# Altium schematic sheet Wifi.SchDoc: Wifi_Main
size A3; Author: TueTD; DrawnBy: TueTD; DocumentNumber: 1; Revision: V1.0; SheetNumber: 1; Stage: DRAFT; ENG_APP_DATE: --/--/--; DSN_APP_DATE: --/--/--; CHK_APP_DATE: --/--/--
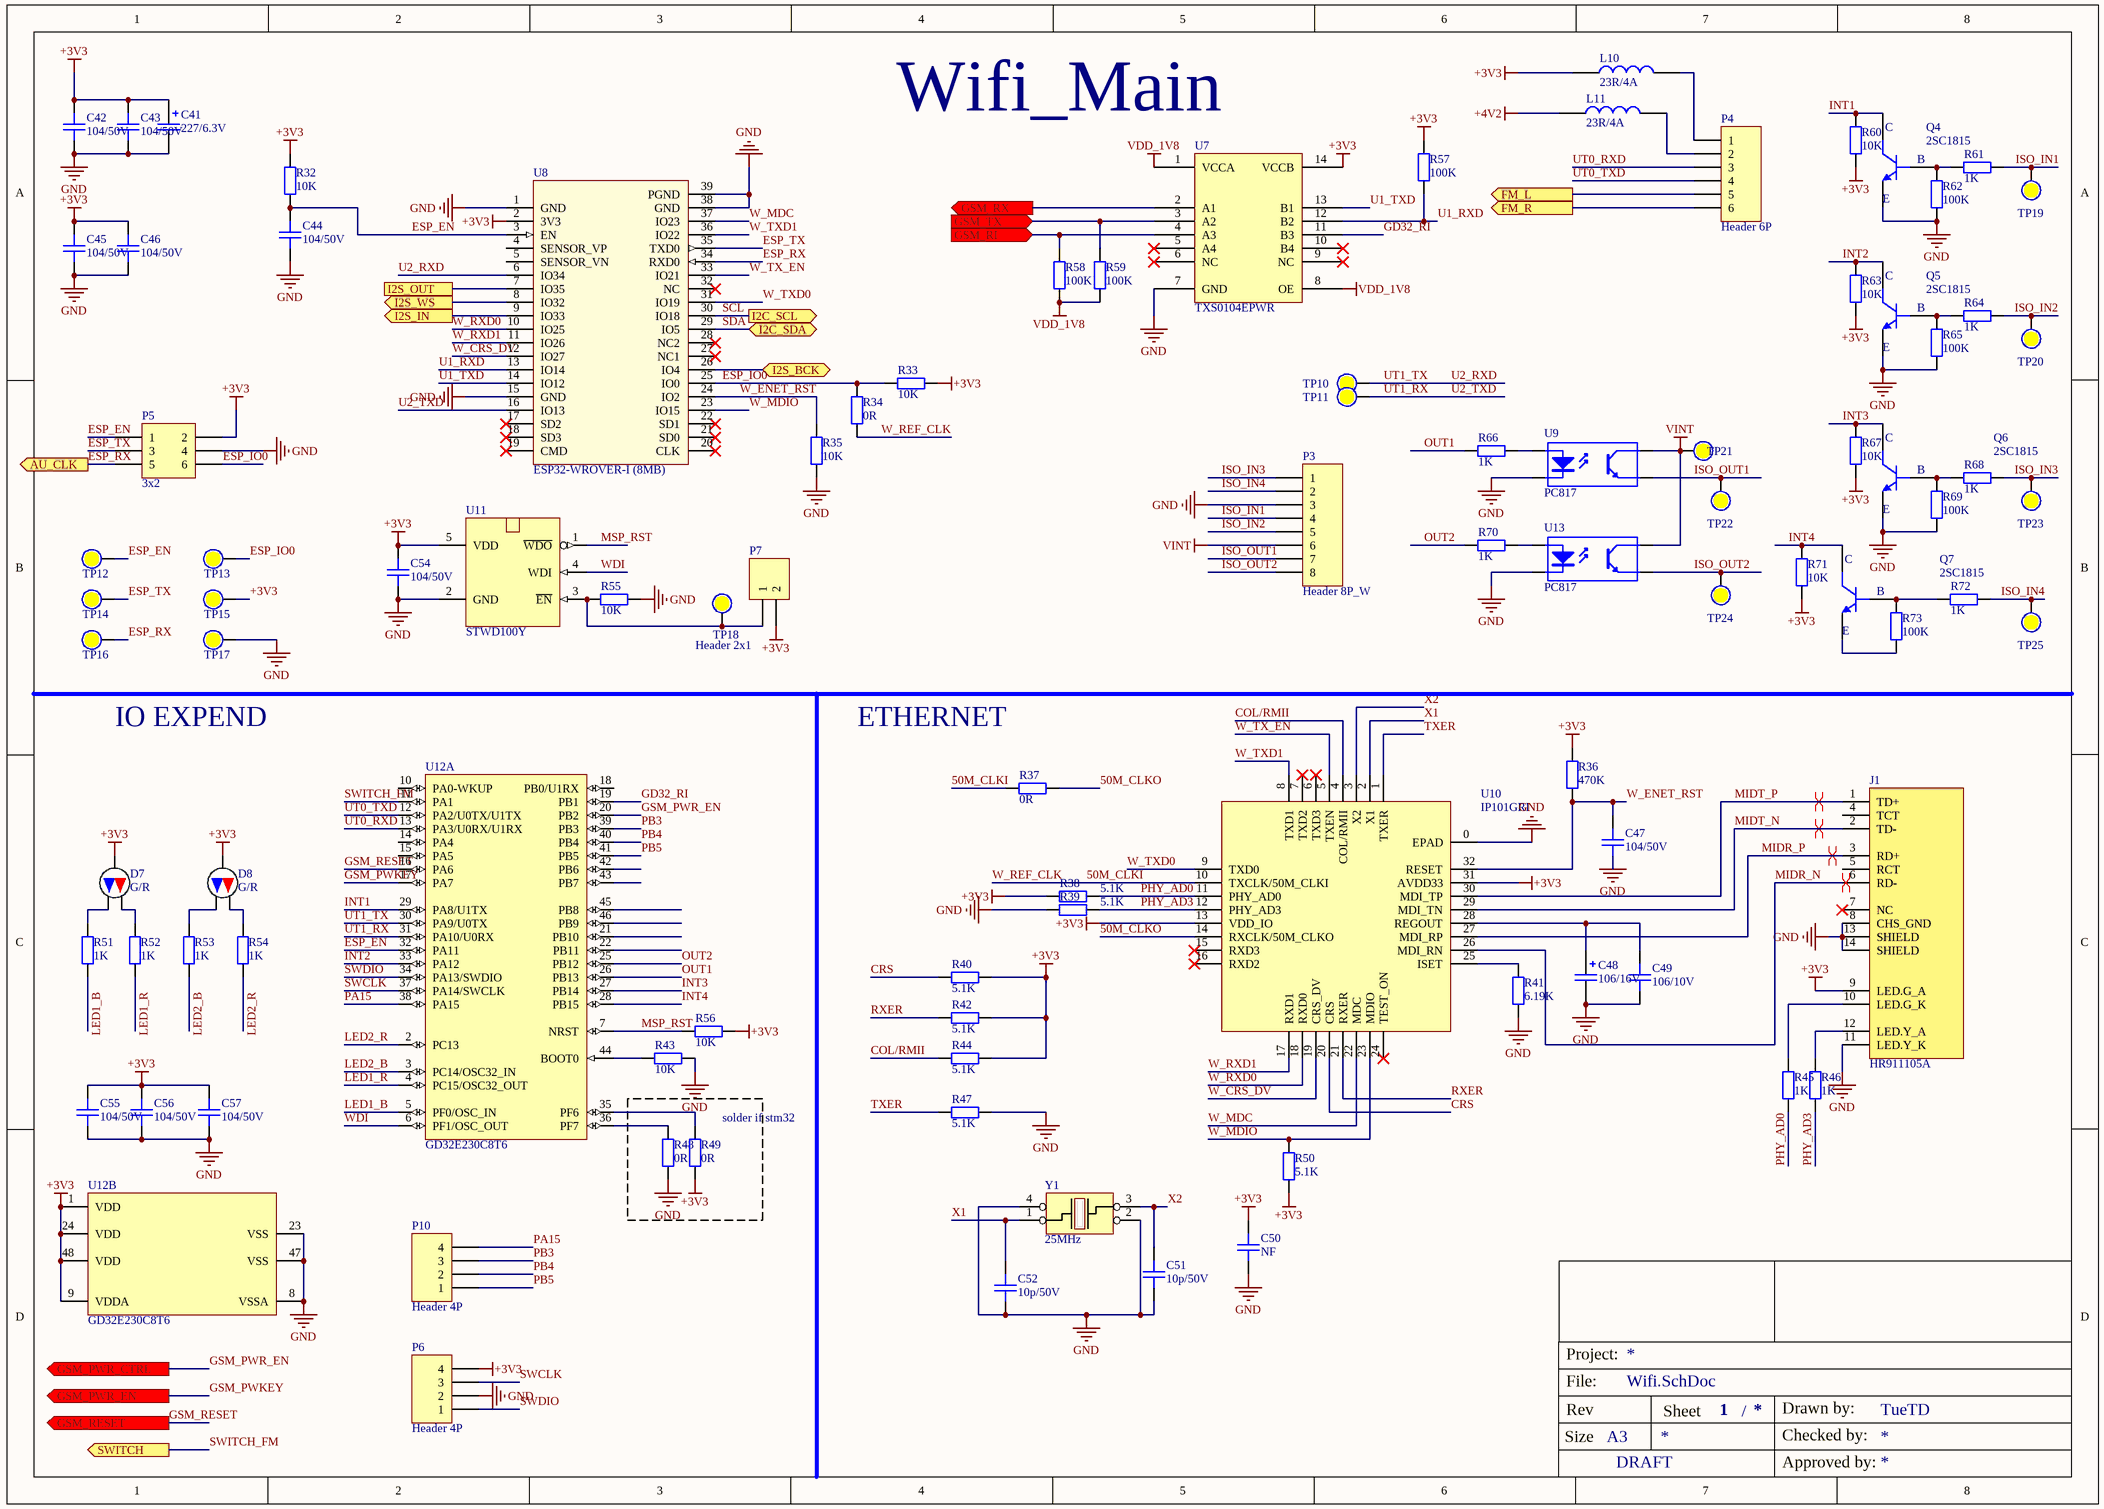
[diagram p0: Wifi.SchDoc]

## Parts
C41  227/6.3V  [CAP_TANTAL_1210(3528)]
C42  104/50V  [CAPC-0603 (1608)]
C43  104/50V  [CAPC-0603 (1608)]
C44  104/50V  [CAPC-0603 (1608)]
C45  104/50V  [CAPC-0603 (1608)]
C46  104/50V  [CAPC-0603 (1608)]
C47  104/50V  [CAPC-0603 (1608)]
C48  106/16V  [CAP_TANTAL_1210(3528)]
C49  106/10V  [CAPC-0603 (1608)]
C50  NF  [CAPC-0603 (1608)]
C51  10p/50V  [CAPC-0603 (1608)]
C52  10p/50V  [CAPC-0603 (1608)]
C54  104/50V  [CAPC-0603 (1608)]
C55  104/50V  [CAPC-0603 (1608)]
C56  104/50V  [CAPC-0603 (1608)]
C57  104/50V  [CAPC-0603 (1608)]
D7  G/R  [LED3301-15]
D8  G/R  [LED3301-15]
J1  HR911105A  [HR911105A]
L10  23R/4A  [IND-0603 (1608)]
L11  23R/4A  [IND-0603 (1608)]
P3  Header 8P_W  [HDR1X8 - W]
P4  Header 6P  [HDR1X6 - W]
P5  3x2  [IDE6 1.27mm]
P6  Header 4P  [HDR1X4]
P7  Header 2x1  [HDR1X2]
P10  Header 4P  [HDR1X4]
Q4  2SC1815  [SOT23_3]
Q5  2SC1815  [SOT23_3]
Q6  2SC1815  [SOT23_3]
Q7  2SC1815  [SOT23_3]
R32  10K  [RESC-0603 (1608)]
R33  10K  [RESC-0603 (1608)]
R34  0R  [RESC-0603 (1608)]
R35  10K  [RESC-0603 (1608)]
R36  470K  [RESC-0603 (1608)]
R37  0R  [RESC-0603 (1608)]
R38  5.1K  [RESC-0603 (1608)]
R39  5.1K  [RESC-0603 (1608)]
R40  5.1K  [RESC-0603 (1608)]
R41  6.19K  [RESC-0603 (1608)]
R42  5.1K  [RESC-0603 (1608)]
R43  10K  [RESC-0603 (1608)]
R44  5.1K  [RESC-0603 (1608)]
R45  1K  [RESC-0603 (1608)]
R46  1K  [RESC-0603 (1608)]
R47  5.1K  [RESC-0603 (1608)]
R48  0R  [RESC-0603 (1608)]
R49  0R  [RESC-0603 (1608)]
R50  5.1K  [RESC-0603 (1608)]
R51  1K  [RESC-0603 (1608)]
R52  1K  [RESC-0603 (1608)]
R53  1K  [RESC-0603 (1608)]
R54  1K  [RESC-0603 (1608)]
R55  10K  [RESC-0603 (1608)]
R56  10K  [RESC-0603 (1608)]
R57  100K  [RESC-0603 (1608)]
R58  100K  [RESC-0603 (1608)]
R59  100K  [RESC-0603 (1608)]
R60  10K  [RESC-0603 (1608)]
R61  1K  [RESC-0603 (1608)]
R62  100K  [RESC-0603 (1608)]
R63  10K  [RESC-0603 (1608)]
R64  1K  [RESC-0603 (1608)]
R65  100K  [RESC-0603 (1608)]
R66  1K  [RESC-0603 (1608)]
R67  10K  [RESC-0603 (1608)]
R68  1K  [RESC-0603 (1608)]
R69  100K  [RESC-0603 (1608)]
R70  1K  [RESC-0603 (1608)]
R71  10K  [RESC-0603 (1608)]
R72  1K  [RESC-0603 (1608)]
R73  100K  [RESC-0603 (1608)]
TP10  (no value)  [Test Point 1.5 MM]  (no BOM)
TP11  (no value)  [Test Point 1.5 MM]  (no BOM)
TP12  (no value)  [Test Point 1.5 MM]  (no BOM)
TP13  (no value)  [Test Point 1.5 MM]  (no BOM)
TP14  (no value)  [Test Point 1.5 MM]  (no BOM)
TP15  (no value)  [Test Point 1.5 MM]  (no BOM)
TP16  (no value)  [Test Point 1.5 MM]  (no BOM)
TP17  (no value)  [Test Point 1.5 MM]  (no BOM)
TP18  (no value)  [Test Point 1.5 MM]  (no BOM)
TP19  (no value)  [Test Point 1.5 MM]  (no BOM)
TP20  (no value)  [Test Point 1.5 MM]  (no BOM)
TP21  (no value)  [Test Point 1.5 MM]  (no BOM)
TP22  (no value)  [Test Point 1.5 MM]  (no BOM)
TP23  (no value)  [Test Point 1.5 MM]  (no BOM)
TP24  (no value)  [Test Point 1.5 MM]  (no BOM)
TP25  (no value)  [Test Point 1.5 MM]  (no BOM)
U7  TXS0104EPWR  [TSOP65P640X120-14N]
U8  ESP32-WROVER-I (8MB)  [ESP32-WROVER]
U9  PC817  [Opto 1]
U10  IP101GRI  [32-VQFN IP101]
U11  STWD100Y  [SOT23-5]
U12  GD32E230C8T6  [LQFP-48]  (parts A,B of 2)
U13  PC817  [Opto 1]
Y1  25MHz  [CRYSTALL_SMD_3225]

## Blocks framed on the sheet
solder if stm32: R48 R49

## Ports
AU_CLK (out), FM_L (out), FM_R (out), GSM_PWR_CTRL (out), GSM_PWR_EN (out), GSM_RESET (out), GSM_RI (in), GSM_RX (out), GSM_TX (in), I2C_SCL (out), I2C_SDA (bidir), I2S_BCK (bidir), I2S_IN (out), I2S_OUT, I2S_WS (out), SWITCH (out)

## Nets
+3V3: C41.1 C42.1 C43.1 C45.1 C46.1 C50.2 C54.2 C55.1 C56.1 C57.1 D7.2(A) D8.2(A) J1.9(LED.G_A) L10.1 P5.2 P6.4 P7.2 R32.2 R33.2 R36.2 R38.2 R40.1 R42.1 R44.1 R49.1 R50.1 R56.2 R57.2 R60.2 R63.2 R67.2 R71.2 TP15.0 U7.14(VCCB) U8.2(3V3) U10.13(VDD_IO) U10.31(AVDD33) U11.5(VDD) U12.1(VDD) U12.9(VDDA) U12.24(VDD) U12.48(VDD)
+4V2: L11.1
GND: C41.2 C42.2 C43.2 C44.1 C45.2 C46.2 C47.1 C48.2 C49.1 C50.1 C51.1 C52.1 C54.1 C55.2 C56.2 C57.2 J1.8(CHS_GND) J1.11(LED.Y_K) J1.13(SHIELD) J1.14(SHIELD) P3.3 P5.4 P6.2 Q4.2(E) Q5.2(E) Q6.2(E) R35.1 R39.2 R41.1 R43.2 R47.1 R48.1 R55.2 R62.1 R65.1 R69.1 TP17.0 U7.7(GND) U8.1(GND) U8.15(GND) U8.38(GND) U8.39(PGND) U9.2(K) U10.0(EPAD) U11.2(GND) U12.8(VSSA) U12.23(VSS) U12.47(VSS) U13.2(K) Y1.2 Y1.4
VDD_1V8: R58.1 R59.1 U7.1(VCCA) U7.8(OE)
VINT: P3.6 TP21.0 U9.4(C) U13.4(C)
50M_CLKI: R34.1 R37.1 U10.10(TXCLK/50M_CLKI)  [also labelled W_REF_CLK]
50M_CLKO: R37.2 U10.14(RXCLK/50M_CLKO)
COL/RMII: R44.2 U10.4(COL/RMII)
CRS: R40.2 U10.20(CRS)
ESP_EN: C44.2 P5.1 R32.1 TP12.0 U8.3(EN) U12.32(PA11)
ESP_IO0: P5.6 R33.1 R34.2 TP13.0 U8.25(IO0)
ESP_RX: P5.5 TP16.0 U8.34(RXD0) ; port AU_CLK
ESP_TX: P5.3 TP14.0 U8.35(TXD0)
FM_L: P4.5 ; port FM_L
FM_R: P4.6 ; port FM_R
GD32_RI: U7.11(B3) U12.19(PB1)
GSM_PWKEY: U12.17(PA7) ; port GSM_PWR_EN
GSM_PWR_EN: U12.20(PB2) ; port GSM_PWR_CTRL
GSM_RESET: U12.16(PA6) ; port GSM_RESET
GSM_RI: R58.2 U7.4(A3) ; port GSM_RI
GSM_RX: U7.2(A1) ; port GSM_RX
GSM_TX: R59.2 U7.3(A2) ; port GSM_TX
I2S_BCK: U8.26(IO4) ; port I2S_BCK
I2S_IN: U8.9(IO33) ; port I2S_IN
I2S_OUT: U8.7(IO35) ; port I2S_OUT
I2S_WS: U8.8(IO32) ; port I2S_WS
INT1: Q4.3(C) R60.1 U12.29(PA8/U1TX)
INT2: Q5.3(C) R63.1 U12.33(PA12)
INT3: Q6.3(C) R67.1 U12.27(PB14)
INT4: Q7.3(C) R71.1 U12.28(PB15)
ISO_IN1: P3.4 R61.2 TP19.0
ISO_IN2: P3.5 R64.2 TP20.0
ISO_IN3: P3.1 R68.2 TP23.0
ISO_IN4: P3.2 R72.2 TP25.0
ISO_OUT1: P3.7 TP22.0 U9.3(E)
ISO_OUT2: P3.8 TP24.0 U13.3(E)
LED1_B: R51.1 U12.5(PF0/OSC_IN)
LED1_R: R52.1 U12.4(PC15/OSC32_OUT)
LED2_B: R53.1 U12.3(PC14/OSC32_IN)
LED2_R: R54.1 U12.2(PC13)
MIDR_N: J1.6(RD-) U10.26(MDI_RN)
MIDR_P: J1.3(RD+) U10.27(MDI_RP)
MIDT_N: J1.2(TD-) U10.29(MDI_TN)
MIDT_P: J1.1(TD+) U10.30(MDI_TP)
MSP_RST: R56.1 U11.1(~{WDO}) U12.7(NRST)
OUT1: R66.1 U12.26(PB13)
OUT2: R70.1 U12.25(PB12)
PA15: P10.4 U12.38(PA15)
PB3: P10.3 U12.39(PB3)
PB4: P10.2 U12.40(PB4)
PB5: P10.1 U12.41(PB5)
PHY_AD0: R38.1 R45.1 U10.11(PHY_AD0)
PHY_AD3: R39.1 R46.1 U10.12(PHY_AD3)
RXER: R42.2 U10.21(RXER)
SCL: U8.30(IO18) ; port I2C_SCL
SDA: U8.29(IO5) ; port I2C_SDA
SWCLK: P6.3 U12.37(PA14/SWCLK)
SWDIO: P6.1 U12.34(PA13/SWDIO)
SWITCH_FM: U12.11(PA1) ; port SWITCH
TXER: R47.2 U10.1(TXER)
U1_RXD: R57.1 U7.12(B2) U8.13(IO14)
U1_TXD: U7.13(B1) U8.14(IO12)
U2_RXD: TP10.0 U8.6(IO34) U12.30(PA9/U0TX)  [also labelled UT1_TX]
U2_TXD: TP11.0 U8.16(IO13) U12.31(PA10/U0RX)  [also labelled UT1_RX]
UT0_RXD: P4.3 U12.13(PA3/U0RX/U1RX)
UT0_TXD: P4.4 U12.12(PA2/U0TX/U1TX)
W_CRS_DV: U8.12(IO27) U10.19(CRS_DV)
W_ENET_RST: C47.2 R35.2 R36.1 U8.24(IO2) U10.32(RESET)
W_MDC: U8.37(IO23) U10.22(MDC)
W_MDIO: R50.2 U8.23(IO15) U10.23(MDIO)
W_RXD0: U8.10(IO25) U10.18(RXD0)
W_RXD1: U8.11(IO26) U10.17(RXD1)
W_TX_EN: U8.33(IO21) U10.5(TXEN)
W_TXD0: U8.31(IO19) U10.9(TXD0)
W_TXD1: U8.36(IO22) U10.8(TXD1)
WDI: U11.4(WDI) U12.6(PF1/OSC_OUT)
X1: C52.2 U10.2(X1) Y1.1
X2: C51.2 U10.3(X2) Y1.3
NetC48_1: C48.1 C49.2 U10.28(REGOUT)
NetD7_1: D7.1(KR) R51.2
NetD7_3: D7.3(KB) R52.2
NetD8_1: D8.1(KR) R53.2
NetD8_3: D8.3(KB) R54.2
NetJ1_10: J1.10(LED.G_K) R45.2
NetJ1_12: J1.12(LED.Y_A) R46.2
NetL10_2: L10.2 P4.1
NetL11_2: L11.2 P4.2
NetP7_1: P7.1 R55.1 TP18.0 U11.3(~{EN})
NetQ4_1: Q4.1(B) R61.1 R62.2
NetQ5_1: Q5.1(B) R64.1 R65.2
NetQ6_1: Q6.1(B) R68.1 R69.2
NetQ7_1: Q7.1(B) R72.1 R73.2
NetQ7_2: Q7.2(E) R73.1
NetR41_2: R41.2 U10.25(ISET)
NetR43_1: R43.1 U12.44(BOOT0)
NetR48_2: R48.2 U12.36(PF7)
NetR49_2: R49.2 U12.35(PF6)
NetR66_2: R66.2 U9.1(A)
NetR70_2: R70.2 U13.1(A)

Not connected (* = marked no-connect by the designer): J1 4(TCT) 5(RCT) 7(NC)*; U7 5(A4)* 6(NC)* 9(NC)* 10(B4)*; U8 4(SENSOR_VP) 5(SENSOR_VN) 17(SD2)* 18(SD3)* 19(CMD)* 20(CLK)* 21(SD0)* 22(SD1)* 27(NC1)* 28(NC2)* 32(NC)*; U10 6(TXD3)* 7(TXD2)* 15(RXD3)* 16(RXD2)* 24(TEST_ON)*; U12 10(PA0-WKUP) 14(PA4) 15(PA5) 18(PB0/U1RX) 21(PB10) 22(PB11) 42(PB6) 43(PB7) 45(PB8) 46(PB9)

## Layout directives
differential pair; differential pair class DIFF100; net class PHY; rule Differential Pairs Routing [Pref Gap = 10mil    Min Gap  = 10mil    Max Gap  = 10milPref Width = 15mil    Min Width  = 15mil    Max Width  = 15mil]: MIDR_N, MIDR_P, MIDT_N, MIDT_P

## Notes on the sheet
- IO EXPEND
- ETHERNET
- Project:
- File:
- Size
- Rev
- A3
- Sheet
- /
- Drawn by:
- Checked by:
- Approved by:

## Library data of the parts
C41 = T520B227M006ATE035: CAP TANT POLY 220uF 20% 6.3V 3528 35mOhm ESR; Solder: SMT; CompanyID: VT-00643; Value: 227/6.3V; MPN: T520B227M006ATE035; Category: CAPACITOR
C42 C43 C45-C47 C54-C57 = C0603C104K5RACTU: CAP CER 0.1uF 50V 10% X7R 0603; CompanyID: VT-00982; Solder: SMT; MPN: C0603C104K5RACTU; Value: 104/50V; Category: CAPACITOR
  C54: PinCount: 2
C44 = C0603C104K5RACTU: CAP CER 0.1uF 50V 10% X7R 0603; Solder: SMT; MPN: C0603C104K5RACTU; CMT: 104/50V; Category: CAPACITOR; PinCount: 2
C48 = TAJB106K016RNJ: CAP TANT 10uF 16V 10% 1411 (3258); CompanyID: VT-01089; Solder: SMT; Value: 106/16V; MPN: TAJB106K016RNJ; Category: CAPACITOR
C49 = CL10A106KP8NNNC: CAP CER 10uF 10% 10V X5R 0603; CompanyID: VT-00984; Solder: SMT; MPN: CL10A106KP8NNNC; Value: 106/10V; Category: CAPACITOR
C50 = CAPC NF 0603: CAP SMD, Not Fill, 0603; Solder: Not Fill; Value: NF; Category: CAPACITOR
C51 C52 = CL10C100JB8NNND: CAP CER 10pF 5% 50V NP0 0603; CompanyID: VT-00983; Solder: SMT; Value: 10p/50V; MPN: CL10C100JB8NNND; Category: CAPACITOR; PinCount: 2
D7 D8 = LED_3MM_RA: LED BLUE/RED DIFFUSED T-1 T/H 3MM; MFR: SunLED; MPN: XLMDKCBD34M; Solder: WAVE; Value: B/R LED; Category: Optoelectronics; PinCount: 3; URL: https://item.taobao.com/item.htm?spm=a230r.1.14.6.66213402V6WLYs&id=605186082192&ns=1&abbucket=1#detail
J1 = HR911105A: Hanrun HR911105A RJ-45 Connector; Solder: WAVE; MPN: HR911105A; MFR: HanRun; Value: HR911105A; ClassName: MECHANICAL
L10 L11 = FBMJ1608HM230NT: IND-FERRITE BEAD 23 OHM  4A 0603 1LN; CompanyID: VT-01060; Solder: SMT; MPN: FBMJ1608HM230NT; Value: 23R/4A; Category: FERRITE BEAD
P3 = Header 8x1: Header, 8 Pin Pitch 2.54mm; Solder: WAVE; Value: Header 8P_W; ClassName: MECHANICAL
P4 = Header 6x1: Header, 6 Pin Pitch 2.54mm; MPN: S1012EC-40-ND; CompanyID: VT-00125; Solder: WAVE; Value: Header 6P; ClassName: MECHANICAL
P5 = IDE6 1.27mm: Header, 6-Pin, Dual row; Solder: WAVE; ClassName: MECHANICAL
P6 P10 = Header 4x1: Header, 4 Pin Pitch 2.54mm; MPN: S1012EC-40-ND; Solder: WAVE; CMT: Header 4P
P7 = Header 2x1: Header, 2-Pin, pitch 2.54mm; Solder: WAVE; ClassName: MECHANICAL
Q4-Q7 = 2SC1815: TRANS NPN 50V 0.15A SOT23-3; Solder: SMT; MPN: 2SC1815; Value: 2SC1815
R32 = RC0603FR-0710KL: RES SMD 10K OHM 1% 1/10W 0603; CompanyID: VT00464; Solder: SMT; MPN: RC0603FR-0710KL; CMT: 10K; Category: RESISTOR
R33 R35 R43 R55 R56 R60 R63 R67 R71 = RC0603FR-0710KL: RES SMD 10K OHM 1% 1/10W 0603; CompanyID: VT-00328; Solder: SMT; MPN: RC0603FR-0710KL; Value: 10K; Category: RESISTOR
R34 R37 R48 R49 = RC0603FR-070RL: RES SMD 0.0OHM JUMPER 1/10W 0603; CompanyID: VT-00901; Solder: SMT; MPN: RC0603FR-070RL; Value: 0R; Category: RESISTOR
R36 = RC0603FR-07470KL: RES SMD 470K OHM 1% 1/10W 0603; Solder: SMT; Value: 470K; MPN: RC0603FR-07470K; Category: RESISTOR
R38-R40 R42 R44 R47 R50 = RC0603FR-0751RL: RES SMD 5.1K OHM 1% 1/10W 0603; MPN: RC0603FR-075K1L; MFR: Yageo; Solder: SMT; Value: 5.1K; Category: RESISTOR
R41 = RC0603FR-0710KL: RES SMD 6.19K OHM 1% 1/10W 0603; CompanyID: VT-00328; Solder: SMT; MPN: RC0603FR-0710KL; Value: 6.19K; Category: RESISTOR
R45 R46 R51-R54 R61 R64 R66 R68 R70 R72 = RC0603FR-071KL: RES SMD 1 KOHM 1% 1/10W 0603; CompanyID: VT-00574; Solder: SMT; MPN: RC0603FR-071KL; Value: 1K; Category: RESISTOR
R57-R59 R62 R65 R69 R73 = RC0603FR-07100KL: RES SMD 100K OHM 1% 1/10W 0603; CompanyID: VT-00332; Solder: SMT; MPN: RC0603FR-07100KL; Value: 100K; Category: RESISTOR
TP10-TP25 = Test Point: Solder: NF
U7 = TXS0104EPWR: IC 4BIT NON-INV TRANSLTR 14TSSOP; Solder: SMT; Value: TXS0104EPWR; MPN: TXS0104EPWR; Category: IC
U8 = esp32 wrover b: RX TXRX MODULE WIFI I-PEX SMD; MFR: Espressif; Solder: SMT; Category: MODULE; MPN: ESP32-WROVER-I (8MB); PinCount: 49; Value: ESP32-WROVER-I (8MB)
U9 U13 = PC817: OPTOISOLATOR 5KV TRANS 4SMD; MFR: SHARP/Socle Technology; MPN: PC81710NIP1B; Solder: SMT; PinCount: 4; Category: IC; Value: PC817
U10 = IP101GRI: 10/100Mbps IEEE 802.3/802.3u compliant / Fast Ethernet transceiver; Solder: SMT; Value: IP101GRI; MPN: IP101GRI; Category: IC
U11 = STWD100YNYWY3F: IC SUPERVISOR 1 CHANNEL SOT23-5 (Time of 1.6s); MFR: ST; MPN: STWD100YNYWY3F; Categories: IC
U12 = GD32E230C8T6: IC MCU 32BIT 64KB FLASH 48LQFP; MFR: GigaDevice; Solder: SMT; Value: GD32E230C8T6; MPN: GD32E230C8T6; Category: IC; PinCount: 48
Y1 = ABM8G-25.000MHZ-18-D2Y-T: CRYSTAL 25.0000MHZ 18PF SMD; MFR: Abracon LLC; Solder: SMT; CompanyID: VT-xxx; MPN: ABM8G-25.000MHZ-18-D2Y-T; Value: 25MHz; Category: CRYSTAL